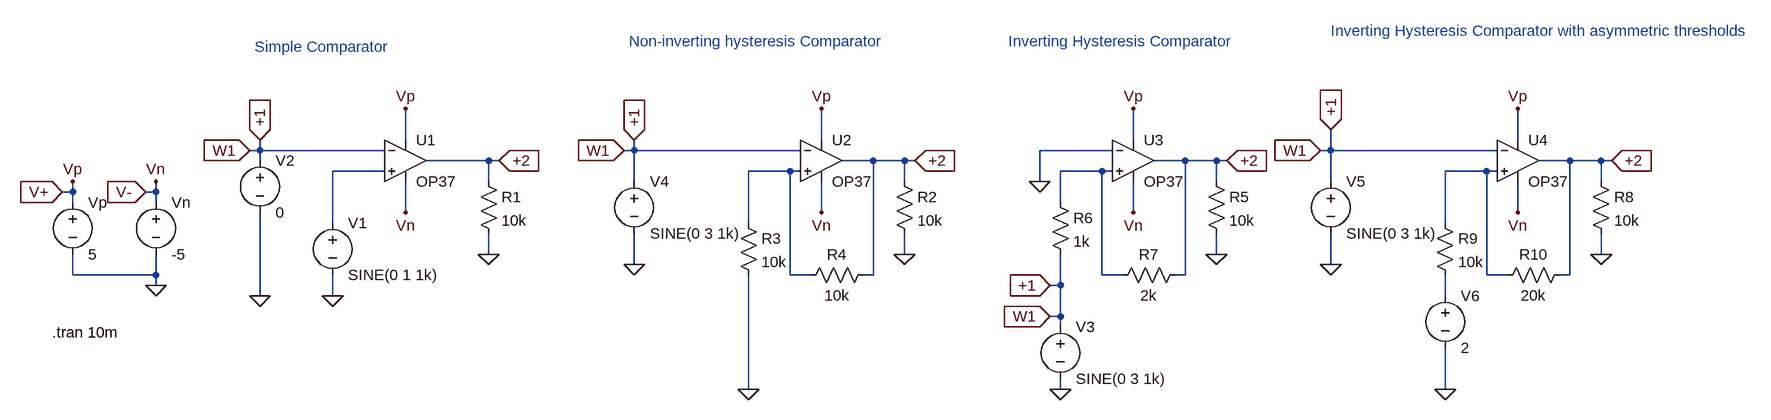
[diagram p0: schematic opamp_comp_ltspice.asc]
opamp_comp_ltspice.asc, the LTspice schematic file:
Version 4
SHEET 1 2016 680
WIRE -96 -128 -96 -176
WIRE 544 -128 544 -176
WIRE 1024 -128 1024 -176
WIRE 1616 -128 1616 -176
WIRE -320 -112 -320 -128
WIRE -320 -112 -336 -112
WIRE -128 -112 -320 -112
WIRE 256 -112 256 -128
WIRE 256 -112 240 -112
WIRE 512 -112 256 -112
WIRE 992 -112 880 -112
WIRE 1328 -112 1328 -144
WIRE 1328 -112 1312 -112
WIRE 1584 -112 1328 -112
WIRE -320 -96 -320 -112
WIRE 32 -96 -64 -96
WIRE 48 -96 32 -96
WIRE 624 -96 576 -96
WIRE 672 -96 624 -96
WIRE 688 -96 672 -96
WIRE 1104 -96 1056 -96
WIRE 1152 -96 1104 -96
WIRE 1168 -96 1152 -96
WIRE 1696 -96 1648 -96
WIRE 1744 -96 1696 -96
WIRE 1760 -96 1744 -96
WIRE -128 -80 -208 -80
WIRE 496 -80 432 -80
WIRE 512 -80 496 -80
WIRE 976 -80 912 -80
WIRE 992 -80 976 -80
WIRE 1568 -80 1504 -80
WIRE 1584 -80 1568 -80
WIRE 32 -64 32 -96
WIRE 256 -64 256 -112
WIRE 672 -64 672 -96
WIRE 880 -64 880 -112
WIRE 1152 -64 1152 -96
WIRE 1328 -64 1328 -112
WIRE 1744 -64 1744 -96
WIRE -608 -48 -608 -64
WIRE -608 -48 -624 -48
WIRE -480 -48 -480 -64
WIRE -480 -48 -496 -48
WIRE -608 -32 -608 -48
WIRE -480 -32 -480 -48
WIRE 912 -32 912 -80
WIRE -96 -16 -96 -64
WIRE 544 -16 544 -64
WIRE 1024 -16 1024 -64
WIRE 1616 -16 1616 -64
WIRE -208 0 -208 -80
WIRE 432 0 432 -80
WIRE 1504 0 1504 -80
WIRE 32 48 32 16
WIRE 672 48 672 16
WIRE 1152 48 1152 16
WIRE 1744 48 1744 16
WIRE 256 64 256 16
WIRE 1328 64 1328 16
WIRE -608 80 -608 48
WIRE -480 80 -480 48
WIRE -480 80 -608 80
WIRE 496 80 496 -80
WIRE 528 80 496 80
WIRE 624 80 624 -96
WIRE 624 80 608 80
WIRE 976 80 976 -80
WIRE 1008 80 976 80
WIRE 1104 80 1104 -96
WIRE 1104 80 1088 80
WIRE 1568 80 1568 -80
WIRE 1600 80 1568 80
WIRE 1696 80 1696 -96
WIRE 1696 80 1680 80
WIRE -480 96 -480 80
WIRE 912 96 912 48
WIRE 912 96 896 96
WIRE -320 112 -320 -16
WIRE -208 112 -208 80
WIRE 1504 112 1504 80
WIRE 912 144 912 96
WIRE 912 144 896 144
WIRE 912 160 912 144
WIRE 432 256 432 80
WIRE 912 256 912 240
WIRE 1504 256 1504 192
FLAG -208 112 0
FLAG -480 96 0
FLAG -608 -64 Vp
FLAG -480 -64 Vn
FLAG -96 -16 Vn
FLAG -96 -176 Vp
FLAG -320 112 0
FLAG 32 48 0
FLAG 432 256 0
FLAG 544 -16 Vn
FLAG 544 -176 Vp
FLAG 672 48 0
FLAG 256 64 0
FLAG 912 256 0
FLAG 1024 -16 Vn
FLAG 1024 -176 Vp
FLAG 1152 48 0
FLAG 880 -64 0
FLAG 1504 256 0
FLAG 1616 -16 Vn
FLAG 1616 -176 Vp
FLAG 1744 48 0
FLAG 1328 64 0
FLAG -336 -112 W1
IOPIN -336 -112 In
FLAG -320 -128 +1
IOPIN -320 -128 In
FLAG 48 -96 +2
IOPIN 48 -96 In
FLAG -624 -48 V+
IOPIN -624 -48 In
FLAG -496 -48 V-
IOPIN -496 -48 In
FLAG 240 -112 W1
IOPIN 240 -112 In
FLAG 256 -128 +1
IOPIN 256 -128 In
FLAG 688 -96 +2
IOPIN 688 -96 In
FLAG 896 96 +1
IOPIN 896 96 In
FLAG 1168 -96 +2
IOPIN 1168 -96 In
FLAG 896 144 W1
IOPIN 896 144 In
FLAG 1328 -144 +1
IOPIN 1328 -144 In
FLAG 1312 -112 W1
IOPIN 1312 -112 In
FLAG 1760 -96 +2
IOPIN 1760 -96 In
SYMBOL voltage -320 -112 R0
WINDOW 123 0 0 Left 0
WINDOW 39 0 0 Left 0
SYMATTR InstName V2
SYMATTR Value 0
SYMBOL voltage -480 -48 R0
WINDOW 123 0 0 Left 0
WINDOW 39 0 0 Left 0
SYMATTR InstName Vn
SYMATTR Value -5
SYMBOL voltage -608 -48 R0
WINDOW 123 0 0 Left 0
WINDOW 39 0 0 Left 0
SYMATTR InstName Vp
SYMATTR Value 5
SYMBOL voltage -208 -16 R0
WINDOW 123 0 0 Left 0
WINDOW 39 0 0 Left 0
SYMATTR InstName V1
SYMATTR Value SINE(0 1 1k)
SYMBOL res 16 -80 R0
SYMATTR InstName R1
SYMATTR Value 10k
SYMBOL voltage 256 -80 R0
WINDOW 123 0 0 Left 0
WINDOW 39 0 0 Left 0
SYMATTR InstName V4
SYMATTR Value SINE(0 3 1k)
SYMBOL res 656 -80 R0
SYMATTR InstName R2
SYMATTR Value 10k
SYMBOL res 416 -16 R0
SYMATTR InstName R3
SYMATTR Value 10k
SYMBOL res 624 64 R90
WINDOW 0 0 56 VBottom 2
WINDOW 3 32 56 VTop 2
SYMATTR InstName R4
SYMATTR Value 10k
SYMBOL Opamps\\OP37 -96 -160 R0
SYMATTR InstName U1
SYMBOL Opamps\\OP37 544 -160 R0
SYMATTR InstName U2
SYMBOL voltage 912 144 R0
WINDOW 123 0 0 Left 0
WINDOW 39 0 0 Left 0
SYMATTR InstName V3
SYMATTR Value SINE(0 3 1k)
SYMBOL res 1136 -80 R0
SYMATTR InstName R5
SYMATTR Value 10k
SYMBOL res 896 -48 R0
SYMATTR InstName R6
SYMATTR Value 1k
SYMBOL res 1104 64 R90
WINDOW 0 0 56 VBottom 2
WINDOW 3 32 56 VTop 2
SYMATTR InstName R7
SYMATTR Value 2k
SYMBOL Opamps\\OP37 1024 -160 R0
SYMATTR InstName U3
SYMBOL voltage 1328 -80 R0
WINDOW 123 0 0 Left 0
WINDOW 39 0 0 Left 0
SYMATTR InstName V5
SYMATTR Value SINE(0 3 1k)
SYMBOL res 1728 -80 R0
SYMATTR InstName R8
SYMATTR Value 10k
SYMBOL res 1488 -16 R0
SYMATTR InstName R9
SYMATTR Value 10k
SYMBOL res 1696 64 R90
WINDOW 0 0 56 VBottom 2
WINDOW 3 32 56 VTop 2
SYMATTR InstName R10
SYMATTR Value 20k
SYMBOL Opamps\\OP37 1616 -160 R0
SYMATTR InstName U4
SYMBOL voltage 1504 96 R0
WINDOW 123 0 0 Left 0
WINDOW 39 0 0 Left 0
SYMATTR InstName V6
SYMATTR Value 2
TEXT -640 168 Left 2 !.tran 10m
TEXT -328 -272 Left 2 ;Simple Comparator
TEXT 248 -280 Left 2 ;Non-inverting hysteresis Comparator
TEXT 832 -280 Left 2 ;Inverting Hysteresis Comparator
TEXT 1328 -296 Left 2 ;Inverting Hysteresis Comparator with asymmetric thresholds

The netlist it stands for:
* opamp_comp_ltspice.asc
V2 +1 0 0
Vn V- 0 -5
Vp V+ 0 5
V1 N001 0 SINE(0 1 1k)
R1 +2 0 10k
V4 +1 0 SINE(0 3 1k)
R2 +2 0 10k
R3 N002 0 10k
R4 +2 N002 10k
XU1 N001 +1 V+ V- +2 LT1037  ; OP37, pins In+ In- V+ V- OUT
XU2 N002 +1 V+ V- +2 LT1037  ; OP37, pins In+ In- V+ V- OUT
V3 +1 0 SINE(0 3 1k)
R5 +2 0 10k
R6 N003 +1 1k
R7 +2 N003 2k
XU3 N003 0 V+ V- +2 LT1037  ; OP37, pins In+ In- V+ V- OUT
V5 +1 0 SINE(0 3 1k)
R8 +2 0 10k
R9 N004 N005 10k
R10 +2 N004 20k
XU4 N004 +1 V+ V- +2 LT1037  ; OP37, pins In+ In- V+ V- OUT
V6 N005 0 2
.tran 10m
* Simple Comparator
* Non-inverting hysteresis Comparator
* Inverting Hysteresis Comparator
* Inverting Hysteresis Comparator with asymmetric thresholds
.lib LTC.lib
.backanno
.end